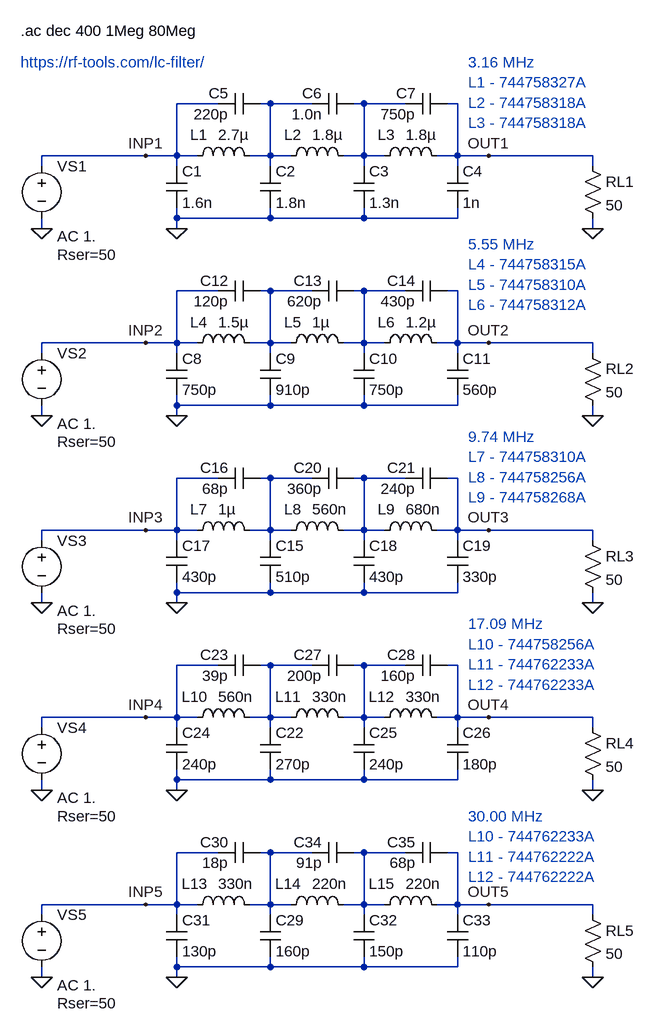
[diagram p0: schematic LPF.asc]
LPF.asc, the LTspice schematic file:
Version 4
SHEET 1 880 2312
WIRE 80 48 16 48
WIRE 160 48 144 48
WIRE 224 48 160 48
WIRE 304 48 288 48
WIRE 368 48 304 48
WIRE 448 48 432 48
WIRE -32 128 -192 128
WIRE 16 128 16 48
WIRE 16 128 -32 128
WIRE 48 128 16 128
WIRE 160 128 160 48
WIRE 160 128 128 128
WIRE 192 128 160 128
WIRE 304 128 304 48
WIRE 304 128 272 128
WIRE 336 128 304 128
WIRE 448 128 448 48
WIRE 448 128 416 128
WIRE 496 128 448 128
WIRE 656 128 496 128
WIRE -192 144 -192 128
WIRE 16 144 16 128
WIRE 160 144 160 128
WIRE 304 144 304 128
WIRE 448 144 448 128
WIRE 656 144 656 128
WIRE 16 224 16 208
WIRE 160 224 160 208
WIRE 160 224 16 224
WIRE 304 224 304 208
WIRE 304 224 160 224
WIRE 448 224 448 208
WIRE 448 224 304 224
WIRE -192 240 -192 224
WIRE 16 240 16 224
WIRE 656 240 656 224
WIRE 80 336 16 336
WIRE 160 336 144 336
WIRE 224 336 160 336
WIRE 304 336 288 336
WIRE 368 336 304 336
WIRE 448 336 432 336
WIRE -32 416 -192 416
WIRE 16 416 16 336
WIRE 16 416 -32 416
WIRE 48 416 16 416
WIRE 160 416 160 336
WIRE 160 416 128 416
WIRE 192 416 160 416
WIRE 304 416 304 336
WIRE 304 416 272 416
WIRE 336 416 304 416
WIRE 448 416 448 336
WIRE 448 416 416 416
WIRE 496 416 448 416
WIRE 656 416 496 416
WIRE -192 432 -192 416
WIRE 16 432 16 416
WIRE 160 432 160 416
WIRE 304 432 304 416
WIRE 448 432 448 416
WIRE 656 432 656 416
WIRE 16 512 16 496
WIRE 160 512 160 496
WIRE 160 512 16 512
WIRE 304 512 304 496
WIRE 304 512 160 512
WIRE 448 512 448 496
WIRE 448 512 304 512
WIRE -192 528 -192 512
WIRE 16 528 16 512
WIRE 656 528 656 512
WIRE 80 624 16 624
WIRE 160 624 144 624
WIRE 224 624 160 624
WIRE 304 624 288 624
WIRE 368 624 304 624
WIRE 448 624 432 624
WIRE -32 704 -192 704
WIRE 16 704 16 624
WIRE 16 704 -32 704
WIRE 48 704 16 704
WIRE 160 704 160 624
WIRE 160 704 128 704
WIRE 192 704 160 704
WIRE 304 704 304 624
WIRE 304 704 272 704
WIRE 336 704 304 704
WIRE 448 704 448 624
WIRE 448 704 416 704
WIRE 496 704 448 704
WIRE 656 704 496 704
WIRE -192 720 -192 704
WIRE 16 720 16 704
WIRE 160 720 160 704
WIRE 304 720 304 704
WIRE 448 720 448 704
WIRE 656 720 656 704
WIRE 16 800 16 784
WIRE 160 800 160 784
WIRE 160 800 16 800
WIRE 304 800 304 784
WIRE 304 800 160 800
WIRE 448 800 448 784
WIRE 448 800 304 800
WIRE -192 816 -192 800
WIRE 16 816 16 800
WIRE 656 816 656 800
WIRE 80 912 16 912
WIRE 160 912 144 912
WIRE 224 912 160 912
WIRE 304 912 288 912
WIRE 368 912 304 912
WIRE 448 912 432 912
WIRE -32 992 -192 992
WIRE 16 992 16 912
WIRE 16 992 -32 992
WIRE 48 992 16 992
WIRE 160 992 160 912
WIRE 160 992 128 992
WIRE 192 992 160 992
WIRE 304 992 304 912
WIRE 304 992 272 992
WIRE 336 992 304 992
WIRE 448 992 448 912
WIRE 448 992 416 992
WIRE 496 992 448 992
WIRE 656 992 496 992
WIRE -192 1008 -192 992
WIRE 16 1008 16 992
WIRE 160 1008 160 992
WIRE 304 1008 304 992
WIRE 448 1008 448 992
WIRE 656 1008 656 992
WIRE 16 1088 16 1072
WIRE 160 1088 160 1072
WIRE 160 1088 16 1088
WIRE 304 1088 304 1072
WIRE 304 1088 160 1088
WIRE 448 1088 448 1072
WIRE 448 1088 304 1088
WIRE -192 1104 -192 1088
WIRE 16 1104 16 1088
WIRE 656 1104 656 1088
WIRE 80 1200 16 1200
WIRE 160 1200 144 1200
WIRE 224 1200 160 1200
WIRE 304 1200 288 1200
WIRE 368 1200 304 1200
WIRE 448 1200 432 1200
WIRE -32 1280 -192 1280
WIRE 16 1280 16 1200
WIRE 16 1280 -32 1280
WIRE 48 1280 16 1280
WIRE 160 1280 160 1200
WIRE 160 1280 128 1280
WIRE 192 1280 160 1280
WIRE 304 1280 304 1200
WIRE 304 1280 272 1280
WIRE 336 1280 304 1280
WIRE 448 1280 448 1200
WIRE 448 1280 416 1280
WIRE 496 1280 448 1280
WIRE 656 1280 496 1280
WIRE -192 1296 -192 1280
WIRE 16 1296 16 1280
WIRE 160 1296 160 1280
WIRE 304 1296 304 1280
WIRE 448 1296 448 1280
WIRE 656 1296 656 1280
WIRE 16 1376 16 1360
WIRE 160 1376 160 1360
WIRE 160 1376 16 1376
WIRE 304 1376 304 1360
WIRE 304 1376 160 1376
WIRE 448 1376 448 1360
WIRE 448 1376 304 1376
WIRE -192 1392 -192 1376
WIRE 16 1392 16 1376
WIRE 656 1392 656 1376
FLAG 16 240 0
FLAG 656 240 0
FLAG 496 128 OUT1
FLAG -32 128 INP1
FLAG -192 240 0
FLAG 16 528 0
FLAG 656 528 0
FLAG 496 416 OUT2
FLAG -32 416 INP2
FLAG -192 528 0
FLAG 16 816 0
FLAG 656 816 0
FLAG 496 704 OUT3
FLAG -32 704 INP3
FLAG -192 816 0
FLAG 16 1104 0
FLAG 656 1104 0
FLAG 496 992 OUT4
FLAG -32 992 INP4
FLAG -192 1104 0
FLAG 16 1392 0
FLAG 656 1392 0
FLAG 496 1280 OUT5
FLAG -32 1280 INP5
FLAG -192 1392 0
SYMBOL ind 32 144 R270
WINDOW 0 48 32 VLeft 2
WINDOW 3 48 48 VRight 2
SYMATTR InstName L1
SYMATTR Value 2.7µ
SYMBOL cap 144 144 R0
SYMATTR InstName C2
SYMATTR Value 1.8n
SYMBOL cap 144 32 R90
WINDOW 0 0 48 VRight 2
WINDOW 3 32 48 VRight 2
SYMATTR InstName C5
SYMATTR Value 220p
SYMBOL cap 0 144 R0
SYMATTR InstName C1
SYMATTR Value 1.6n
SYMBOL ind 176 144 R270
WINDOW 0 48 32 VLeft 2
WINDOW 3 48 48 VRight 2
SYMATTR InstName L2
SYMATTR Value 1.8µ
SYMBOL ind 320 144 R270
WINDOW 0 48 32 VLeft 2
WINDOW 3 48 48 VRight 2
SYMATTR InstName L3
SYMATTR Value 1.8µ
SYMBOL cap 288 144 R0
SYMATTR InstName C3
SYMATTR Value 1.3n
SYMBOL cap 432 144 R0
SYMATTR InstName C4
SYMATTR Value 1n
SYMBOL cap 288 32 R90
WINDOW 0 0 48 VRight 2
WINDOW 3 32 48 VRight 2
SYMATTR InstName C6
SYMATTR Value 1.0n
SYMBOL cap 432 32 R90
WINDOW 0 0 48 VRight 2
WINDOW 3 32 48 VRight 2
SYMATTR InstName C7
SYMATTR Value 750p
SYMBOL res 640 128 R0
SYMATTR InstName RL1
SYMATTR Value 50
SYMBOL voltage -192 128 R0
WINDOW 3 24 180 Left 2
WINDOW 123 24 124 Left 2
WINDOW 39 24 152 Left 2
SYMATTR Value ""
SYMATTR Value2 AC 1.
SYMATTR SpiceLine Rser=50
SYMATTR InstName VS1
SYMBOL ind 32 432 R270
WINDOW 0 48 32 VLeft 2
WINDOW 3 48 48 VRight 2
SYMATTR InstName L4
SYMATTR Value 1.5µ
SYMBOL cap 144 432 R0
SYMATTR InstName C9
SYMATTR Value 910p
SYMBOL cap 144 320 R90
WINDOW 0 0 48 VRight 2
WINDOW 3 32 48 VRight 2
SYMATTR InstName C12
SYMATTR Value 120p
SYMBOL cap 0 432 R0
SYMATTR InstName C8
SYMATTR Value 750p
SYMBOL ind 176 432 R270
WINDOW 0 48 32 VLeft 2
WINDOW 3 48 48 VRight 2
SYMATTR InstName L5
SYMATTR Value 1µ
SYMBOL ind 320 432 R270
WINDOW 0 48 32 VLeft 2
WINDOW 3 48 48 VRight 2
SYMATTR InstName L6
SYMATTR Value 1.2µ
SYMBOL cap 288 432 R0
SYMATTR InstName C10
SYMATTR Value 750p
SYMBOL cap 432 432 R0
SYMATTR InstName C11
SYMATTR Value 560p
SYMBOL cap 288 320 R90
WINDOW 0 0 48 VRight 2
WINDOW 3 32 48 VRight 2
SYMATTR InstName C13
SYMATTR Value 620p
SYMBOL cap 432 320 R90
WINDOW 0 0 48 VRight 2
WINDOW 3 32 48 VRight 2
SYMATTR InstName C14
SYMATTR Value 430p
SYMBOL res 640 416 R0
SYMATTR InstName RL2
SYMATTR Value 50
SYMBOL voltage -192 416 R0
WINDOW 3 24 180 Left 2
WINDOW 123 24 124 Left 2
WINDOW 39 24 152 Left 2
SYMATTR Value ""
SYMATTR Value2 AC 1.
SYMATTR SpiceLine Rser=50
SYMATTR InstName VS2
SYMBOL ind 32 720 R270
WINDOW 0 48 32 VLeft 2
WINDOW 3 48 48 VRight 2
SYMATTR InstName L7
SYMATTR Value 1µ
SYMBOL cap 144 720 R0
SYMATTR InstName C15
SYMATTR Value 510p
SYMBOL cap 144 608 R90
WINDOW 0 0 48 VRight 2
WINDOW 3 32 48 VRight 2
SYMATTR InstName C16
SYMATTR Value 68p
SYMBOL cap 0 720 R0
SYMATTR InstName C17
SYMATTR Value 430p
SYMBOL ind 176 720 R270
WINDOW 0 48 32 VLeft 2
WINDOW 3 48 48 VRight 2
SYMATTR InstName L8
SYMATTR Value 560n
SYMBOL ind 320 720 R270
WINDOW 0 48 32 VLeft 2
WINDOW 3 48 48 VRight 2
SYMATTR InstName L9
SYMATTR Value 680n
SYMBOL cap 288 720 R0
SYMATTR InstName C18
SYMATTR Value 430p
SYMBOL cap 432 720 R0
SYMATTR InstName C19
SYMATTR Value 330p
SYMBOL cap 288 608 R90
WINDOW 0 0 48 VRight 2
WINDOW 3 32 48 VRight 2
SYMATTR InstName C20
SYMATTR Value 360p
SYMBOL cap 432 608 R90
WINDOW 0 0 48 VRight 2
WINDOW 3 32 48 VRight 2
SYMATTR InstName C21
SYMATTR Value 240p
SYMBOL res 640 704 R0
SYMATTR InstName RL3
SYMATTR Value 50
SYMBOL voltage -192 704 R0
WINDOW 3 24 180 Left 2
WINDOW 123 24 124 Left 2
WINDOW 39 24 152 Left 2
SYMATTR Value ""
SYMATTR Value2 AC 1.
SYMATTR SpiceLine Rser=50
SYMATTR InstName VS3
SYMBOL ind 32 1008 R270
WINDOW 0 48 32 VLeft 2
WINDOW 3 48 48 VRight 2
SYMATTR InstName L10
SYMATTR Value 560n
SYMBOL cap 144 1008 R0
SYMATTR InstName C22
SYMATTR Value 270p
SYMBOL cap 144 896 R90
WINDOW 0 0 48 VRight 2
WINDOW 3 32 48 VRight 2
SYMATTR InstName C23
SYMATTR Value 39p
SYMBOL cap 0 1008 R0
SYMATTR InstName C24
SYMATTR Value 240p
SYMBOL ind 176 1008 R270
WINDOW 0 48 32 VLeft 2
WINDOW 3 48 48 VRight 2
SYMATTR InstName L11
SYMATTR Value 330n
SYMBOL ind 320 1008 R270
WINDOW 0 48 32 VLeft 2
WINDOW 3 48 48 VRight 2
SYMATTR InstName L12
SYMATTR Value 330n
SYMBOL cap 288 1008 R0
SYMATTR InstName C25
SYMATTR Value 240p
SYMBOL cap 432 1008 R0
SYMATTR InstName C26
SYMATTR Value 180p
SYMBOL cap 288 896 R90
WINDOW 0 0 48 VRight 2
WINDOW 3 32 48 VRight 2
SYMATTR InstName C27
SYMATTR Value 200p
SYMBOL cap 432 896 R90
WINDOW 0 0 48 VRight 2
WINDOW 3 32 48 VRight 2
SYMATTR InstName C28
SYMATTR Value 160p
SYMBOL res 640 992 R0
SYMATTR InstName RL4
SYMATTR Value 50
SYMBOL voltage -192 992 R0
WINDOW 3 24 180 Left 2
WINDOW 123 24 124 Left 2
WINDOW 39 24 152 Left 2
SYMATTR Value ""
SYMATTR Value2 AC 1.
SYMATTR SpiceLine Rser=50
SYMATTR InstName VS4
SYMBOL ind 32 1296 R270
WINDOW 0 48 32 VLeft 2
WINDOW 3 48 48 VRight 2
SYMATTR InstName L13
SYMATTR Value 330n
SYMBOL cap 144 1296 R0
SYMATTR InstName C29
SYMATTR Value 160p
SYMBOL cap 144 1184 R90
WINDOW 0 0 48 VRight 2
WINDOW 3 32 48 VRight 2
SYMATTR InstName C30
SYMATTR Value 18p
SYMBOL cap 0 1296 R0
SYMATTR InstName C31
SYMATTR Value 130p
SYMBOL ind 176 1296 R270
WINDOW 0 48 32 VLeft 2
WINDOW 3 48 48 VRight 2
SYMATTR InstName L14
SYMATTR Value 220n
SYMBOL ind 320 1296 R270
WINDOW 0 48 32 VLeft 2
WINDOW 3 48 48 VRight 2
SYMATTR InstName L15
SYMATTR Value 220n
SYMBOL cap 288 1296 R0
SYMATTR InstName C32
SYMATTR Value 150p
SYMBOL cap 432 1296 R0
SYMATTR InstName C33
SYMATTR Value 110p
SYMBOL cap 288 1184 R90
WINDOW 0 0 48 VRight 2
WINDOW 3 32 48 VRight 2
SYMATTR InstName C34
SYMATTR Value 91p
SYMBOL cap 432 1184 R90
WINDOW 0 0 48 VRight 2
WINDOW 3 32 48 VRight 2
SYMATTR InstName C35
SYMATTR Value 68p
SYMBOL res 640 1280 R0
SYMATTR InstName RL5
SYMATTR Value 50
SYMBOL voltage -192 1280 R0
WINDOW 3 24 180 Left 2
WINDOW 123 24 124 Left 2
WINDOW 39 24 152 Left 2
SYMATTR Value ""
SYMATTR Value2 AC 1.
SYMATTR SpiceLine Rser=50
SYMATTR InstName VS5
TEXT -224 -64 Left 2 !.ac dec 400 1Meg 80Meg
TEXT 464 264 Left 2 ;5.55 MHz\nL4 - 744758315A\nL5 - 744758310A\nL6 - 744758312A
TEXT 464 560 Left 2 ;9.74 MHz\nL7 - 744758310A\nL8 - 744758256A\nL9 - 744758268A
TEXT 464 848 Left 2 ;17.09 MHz\nL10 - 744758256A\nL11 - 744762233A\nL12 - 744762233A
TEXT 464 1144 Left 2 ;30.00 MHz\nL10 - 744762233A\nL11 - 744762222A\nL12 - 744762222A
TEXT -224 -16 Left 2 ;https://rf-tools.com/lc-filter/
TEXT 464 -16 Left 2 ;3.16 MHz\nL1 - 744758327A\nL2 - 744758318A\nL3 - 744758318A

The netlist it stands for:
* LPF.asc
L1 INP1 N001 2.7µ
C2 N001 0 1.8n
C5 N001 INP1 220p
C1 INP1 0 1.6n
L2 N001 N002 1.8µ
L3 N002 OUT1 1.8µ
C3 N002 0 1.3n
C4 OUT1 0 1n
C6 N002 N001 1.0n
C7 OUT1 N002 750p
RL1 OUT1 0 50
VS1 INP1 0 AC 1. Rser=50
L4 INP2 N003 1.5µ
C9 N003 0 910p
C12 N003 INP2 120p
C8 INP2 0 750p
L5 N003 N004 1µ
L6 N004 OUT2 1.2µ
C10 N004 0 750p
C11 OUT2 0 560p
C13 N004 N003 620p
C14 OUT2 N004 430p
RL2 OUT2 0 50
VS2 INP2 0 AC 1. Rser=50
L7 INP3 N005 1µ
C15 N005 0 510p
C16 N005 INP3 68p
C17 INP3 0 430p
L8 N005 N006 560n
L9 N006 OUT3 680n
C18 N006 0 430p
C19 OUT3 0 330p
C20 N006 N005 360p
C21 OUT3 N006 240p
RL3 OUT3 0 50
VS3 INP3 0 AC 1. Rser=50
L10 INP4 N007 560n
C22 N007 0 270p
C23 N007 INP4 39p
C24 INP4 0 240p
L11 N007 N008 330n
L12 N008 OUT4 330n
C25 N008 0 240p
C26 OUT4 0 180p
C27 N008 N007 200p
C28 OUT4 N008 160p
RL4 OUT4 0 50
VS4 INP4 0 AC 1. Rser=50
L13 INP5 N009 330n
C29 N009 0 160p
C30 N009 INP5 18p
C31 INP5 0 130p
L14 N009 N010 220n
L15 N010 OUT5 220n
C32 N010 0 150p
C33 OUT5 0 110p
C34 N010 N009 91p
C35 OUT5 N010 68p
RL5 OUT5 0 50
VS5 INP5 0 AC 1. Rser=50
.ac dec 400 1Meg 80Meg
* 5.55 MHz
* L4 - 744758315A
* L5 - 744758310A
* L6 - 744758312A
* 9.74 MHz
* L7 - 744758310A
* L8 - 744758256A
* L9 - 744758268A
* 17.09 MHz
* L10 - 744758256A
* L11 - 744762233A
* L12 - 744762233A
* 30.00 MHz
* L10 - 744762233A
* L11 - 744762222A
* L12 - 744762222A
* https://rf-tools.com/lc-filter/
* 3.16 MHz
* L1 - 744758327A
* L2 - 744758318A
* L3 - 744758318A
.backanno
.end